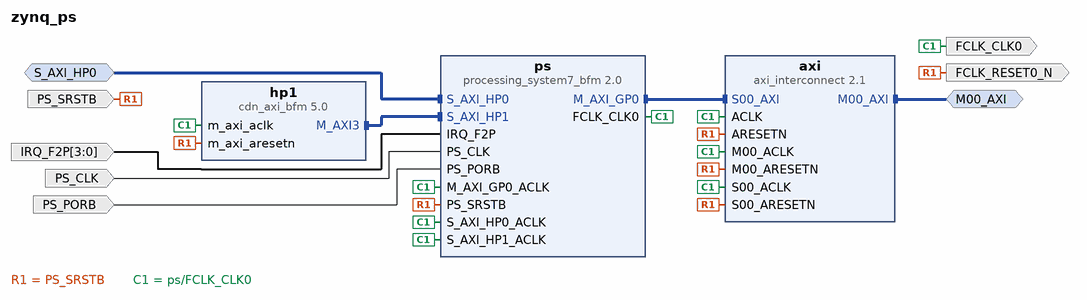
[diagram p0: block diagram of the top level]
# Vivado block design zynq_ps, Vivado 2015.1
create_bd_design zynq_ps

create_bd_intf_port -mode Master -vlnv xilinx.com:interface:aximm_rtl:1.0 M00_AXI
set_property -dict [list \
  CONFIG.DATA_WIDTH 32 \
  CONFIG.PROTOCOL AXI4LITE \
  CONFIG.ADDR_WIDTH 32 \
  CONFIG.NUM_READ_OUTSTANDING 2 \
  CONFIG.NUM_WRITE_OUTSTANDING 2 \
] [get_bd_intf_ports M00_AXI]
create_bd_intf_port -mode Slave -vlnv xilinx.com:interface:aximm_rtl:1.0 S_AXI_HP0
set_property -dict [list \
  CONFIG.DATA_WIDTH 32 \
  CONFIG.PROTOCOL AXI3 \
  CONFIG.ID_WIDTH 6 \
  CONFIG.ADDR_WIDTH 32 \
  CONFIG.AWUSER_WIDTH 0 \
  CONFIG.ARUSER_WIDTH 0 \
  CONFIG.WUSER_WIDTH 0 \
  CONFIG.RUSER_WIDTH 0 \
  CONFIG.BUSER_WIDTH 0 \
  CONFIG.READ_WRITE_MODE READ_WRITE \
  CONFIG.SUPPORTS_NARROW_BURST 1 \
  CONFIG.NUM_READ_OUTSTANDING 2 \
  CONFIG.NUM_WRITE_OUTSTANDING 2 \
  CONFIG.MAX_BURST_LENGTH 16 \
  CONFIG.PHASE 0.000 \
] [get_bd_intf_ports S_AXI_HP0]
create_bd_port -dir I -from 3 -to 0 -type intr IRQ_F2P
set_property -dict {CONFIG.PortWidth 4} [get_bd_ports IRQ_F2P]
create_bd_port -dir I PS_CLK
create_bd_port -dir I PS_PORB
create_bd_port -dir I PS_SRSTB
create_bd_port -dir O -type clk FCLK_CLK0
set_property -dict {CONFIG.ASSOCIATED_BUSIF M00_AXI:S_AXI_HP0} [get_bd_ports FCLK_CLK0]
create_bd_port -dir O -type rst FCLK_RESET0_N

create_bd_cell -type ip -vlnv xilinx.com:ip:axi_interconnect:2.1 axi
set_property -dict {CONFIG.NUM_MI 1} [get_bd_cells axi]
create_bd_cell -type ip -vlnv xilinx.com:ip:cdn_axi_bfm:5.0 hp1
set_property -dict {CONFIG.C_PROTOCOL_SELECTION 0} [get_bd_cells hp1]
create_bd_cell -type ip -vlnv xilinx.com:ip:processing_system7_bfm:2.0 ps
set_property -dict [list \
  CONFIG.PCW_USE_S_AXI_HP0 1 \
  CONFIG.PCW_USE_S_AXI_HP1 1 \
  CONFIG.PCW_S_AXI_HP0_DATA_WIDTH 32 \
  CONFIG.PCW_FCLK_CLK0_FREQ 125000000 \
] [get_bd_cells ps]
# 1 more settings of ps are not shown: defaults, MIO pin electricals, DDR timing, and values the tool derives

# ---- connections ----

connect_bd_intf_net -intf_net cdn_axi_bfm_0_M_AXI3 [get_bd_intf_pins hp1/M_AXI3] [get_bd_intf_pins ps/S_AXI_HP1]
connect_bd_intf_net -intf_net processing_system7_bfm_0_M_AXI_GP0 [get_bd_intf_pins axi/S00_AXI] [get_bd_intf_pins ps/M_AXI_GP0]
connect_bd_intf_net -intf_net axi_interconnect_0_M00_AXI [get_bd_intf_ports M00_AXI] [get_bd_intf_pins axi/M00_AXI]
connect_bd_intf_net -intf_net S_AXI_HP0_1 [get_bd_intf_ports S_AXI_HP0] [get_bd_intf_pins ps/S_AXI_HP0]
connect_bd_net [get_bd_ports IRQ_F2P] [get_bd_pins ps/IRQ_F2P]
connect_bd_net [get_bd_ports PS_CLK] [get_bd_pins ps/PS_CLK]
connect_bd_net [get_bd_ports PS_PORB] [get_bd_pins ps/PS_PORB]
connect_bd_net [get_bd_ports PS_SRSTB] \
  [get_bd_pins ps/PS_SRSTB] [get_bd_ports FCLK_RESET0_N] [get_bd_pins hp1/m_axi_aresetn] [get_bd_pins axi/ARESETN] \
  [get_bd_pins axi/S00_ARESETN] [get_bd_pins axi/M00_ARESETN]
connect_bd_net -net processing_system7_bfm_0_FCLK_CLK0 [get_bd_pins ps/FCLK_CLK0] \
  [get_bd_ports FCLK_CLK0] [get_bd_pins hp1/m_axi_aclk] [get_bd_pins ps/M_AXI_GP0_ACLK] [get_bd_pins ps/S_AXI_HP0_ACLK] \
  [get_bd_pins ps/S_AXI_HP1_ACLK] [get_bd_pins axi/ACLK] [get_bd_pins axi/M00_ACLK] [get_bd_pins axi/S00_ACLK]

# ---- address map ----
assign_bd_address -offset 0x00000000 -range 1G -target_address_space [get_bd_addr_spaces hp1/Data] [get_bd_addr_segs ps/S_AXI_HP1/HP1_DDR_LOWOCM]
assign_bd_address -offset 0x43C00000 -range 128K -target_address_space [get_bd_addr_spaces ps/Data] [get_bd_addr_segs M00_AXI/Reg]
assign_bd_address -offset 0x00000000 -range 1G -target_address_space [get_bd_addr_spaces S_AXI_HP0] [get_bd_addr_segs ps/S_AXI_HP0/HP0_DDR_LOWOCM]

validate_bd_design
save_bd_design
